# EAGLE design raspicam-lamp (EAGLE 9.1.0)
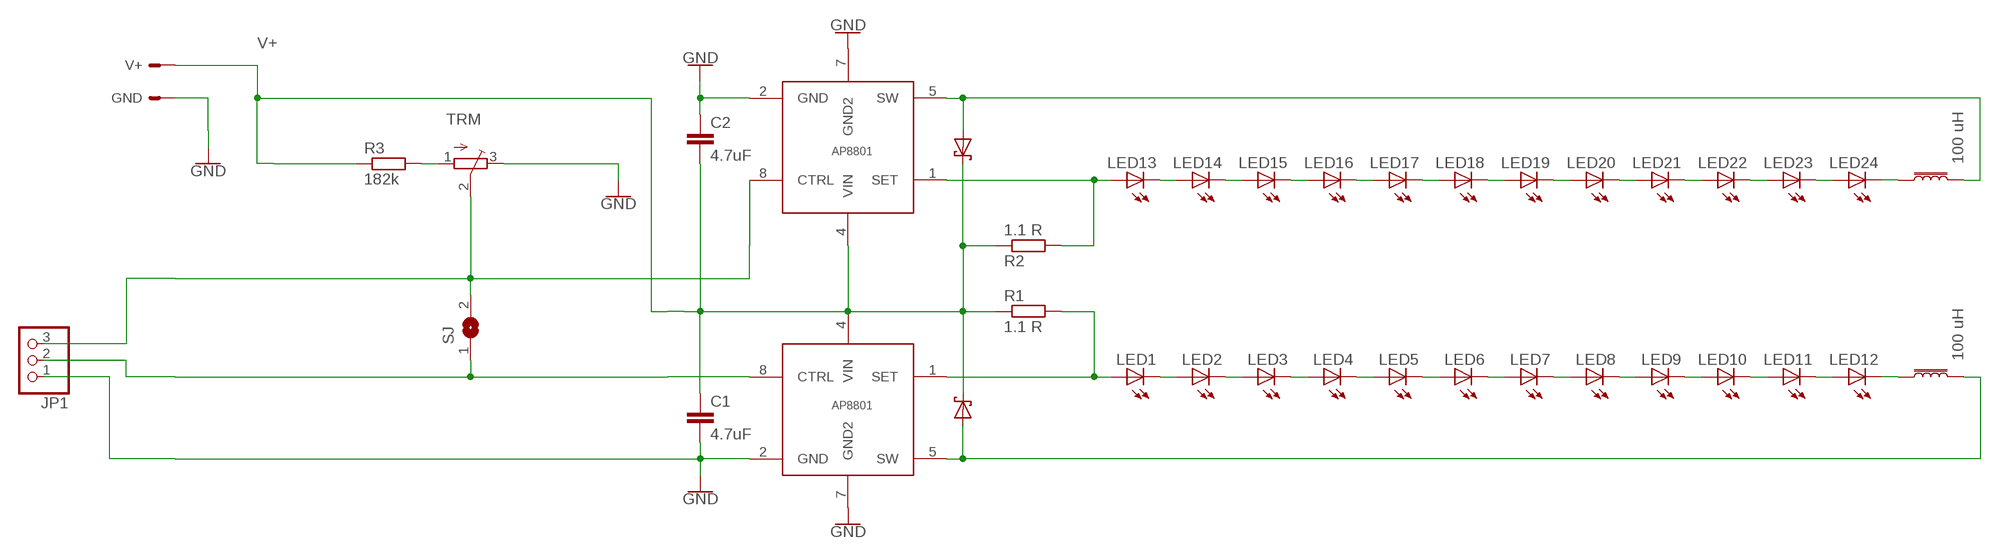
[diagram p0: schematic, sheet 1]

## Parts
C1  4.7uF  C-EUC3225  [C3225]
C2  4.7uF  C-EUC3225  [C3225]
GND  PWR_PAD  [PWR_PAD_FP]
JP1  PINHD-1X03_2.54-SMD-90°  [1X03SMD/90]
L1  100 uH  SRN8040TA-101M  [SRN8040TA-101M]
L2  100 uH  SRN8040TA-101M  [SRN8040TA-101M]
LED1  GW-JDSTS2.EM  [GW-JDSTS2.EM]
LED2  GW-JDSTS2.EM  [GW-JDSTS2.EM]
LED3  GW-JDSTS2.EM  [GW-JDSTS2.EM]
LED4  GW-JDSTS2.EM  [GW-JDSTS2.EM]
LED5  GW-JDSTS2.EM  [GW-JDSTS2.EM]
LED6  GW-JDSTS2.EM  [GW-JDSTS2.EM]
LED7  GW-JDSTS2.EM  [GW-JDSTS2.EM]
LED8  GW-JDSTS2.EM  [GW-JDSTS2.EM]
LED9  GW-JDSTS2.EM  [GW-JDSTS2.EM]
LED10  GW-JDSTS2.EM  [GW-JDSTS2.EM]
LED11  GW-JDSTS2.EM  [GW-JDSTS2.EM]
LED12  GW-JDSTS2.EM  [GW-JDSTS2.EM]
LED13  GW-JDSTS2.EM  [GW-JDSTS2.EM]
LED14  GW-JDSTS2.EM  [GW-JDSTS2.EM]
LED15  GW-JDSTS2.EM  [GW-JDSTS2.EM]
LED16  GW-JDSTS2.EM  [GW-JDSTS2.EM]
LED17  GW-JDSTS2.EM  [GW-JDSTS2.EM]
LED18  GW-JDSTS2.EM  [GW-JDSTS2.EM]
LED19  GW-JDSTS2.EM  [GW-JDSTS2.EM]
LED20  GW-JDSTS2.EM  [GW-JDSTS2.EM]
LED21  GW-JDSTS2.EM  [GW-JDSTS2.EM]
LED22  GW-JDSTS2.EM  [GW-JDSTS2.EM]
LED23  GW-JDSTS2.EM  [GW-JDSTS2.EM]
LED24  GW-JDSTS2.EM  [GW-JDSTS2.EM]
R1  1.1 R  R-EU_R0603  [R0603]
R2  1.1 R  R-EU_R0603  [R0603]
R3  182k  R-EU_R0603  [R0603]
SD1  SCHOTTKY-DO-2014AC  [SCHOTTKY-DO-214AC]
SD2  SCHOTTKY-DO-2014AC  [SCHOTTKY-DO-214AC]
SJ  SJ  [SJ]
TRM  TRIMPOTTC33X  [TC33X]
U$1  AP8801  [SO08]
U$2  AP8801  [SO08]
V+  PWR_PAD  [PWR_PAD_FP]

## Nets
GND: C1.2 C2.1 GND.P$1(S) JP1.1 TRM.3(E) U$1.2(GND) U$1.7(GND2) U$2.2(GND) U$2.7(GND2)
N$1: L1.2 SD2.A U$2.5(SW)
N$3: LED1.A R1.2 U$1.1(SET)
N$4: JP1.2 SJ.1 U$1.8(CTRL)
N$5: R3.2 TRM.1(A)
N$6: JP1.3 SJ.2 TRM.2(S) U$2.8(CTRL)
N$7: L2.2 SD1.A U$1.5(SW)
N$8: LED13.A R2.2 U$2.1(SET)
N$9: LED1.C LED2.A
N$10: LED2.C LED3.A
N$11: LED3.C LED4.A
N$12: LED4.C LED5.A
N$13: LED5.C LED6.A
N$14: LED6.C LED7.A
N$15: LED7.C LED8.A
N$16: LED8.C LED9.A
N$17: LED9.C LED10.A
N$18: LED10.C LED11.A
N$19: LED11.C LED12.A
N$20: LED13.C LED14.A
N$21: LED14.C LED15.A
N$22: LED15.C LED16.A
N$23: LED16.C LED17.A
N$24: LED17.C LED18.A
N$25: LED18.C LED19.A
N$26: LED19.C LED20.A
N$27: LED20.C LED21.A
N$28: LED21.C LED22.A
N$29: LED22.C LED23.A
N$30: LED23.C LED24.A
N$31: L2.1 LED12.C
N$32: L1.1 LED24.C
V+: C1.1 C2.2 R1.1 R2.1 R3.1 SD1.C SD2.C U$1.4(VIN) U$2.4(VIN) V+.P$1(S)

## Library data of the parts
C1 C2 = rcl:C-EU: CAPACITOR, European symbol; SPICEPREFIX: C
GND V+ = con_usr:PWR_PAD
JP1 = pinhead-2:PINHD-1X03: PIN HEADER
L1 L2 = LightLibrary:SRN8040TA-101M
LED1-LED24 = LightLibrary:GW-JDSTS2.EM
R1-R3 = rcl:R-EU_: RESISTOR, European symbol; SPICEPREFIX: R
SD1 SD2 = LightLibrary:SCHOTTKY-DO-2014AC
SJ = jumper:SJ: SMD solder JUMPER
TRM = adafruit:TRIMPOT: SMT trimmer potentiometer part number TC33X http://www.ladyada.net/library/eagle
U$1 U$2 = LightLibrary:AP8801

## Board
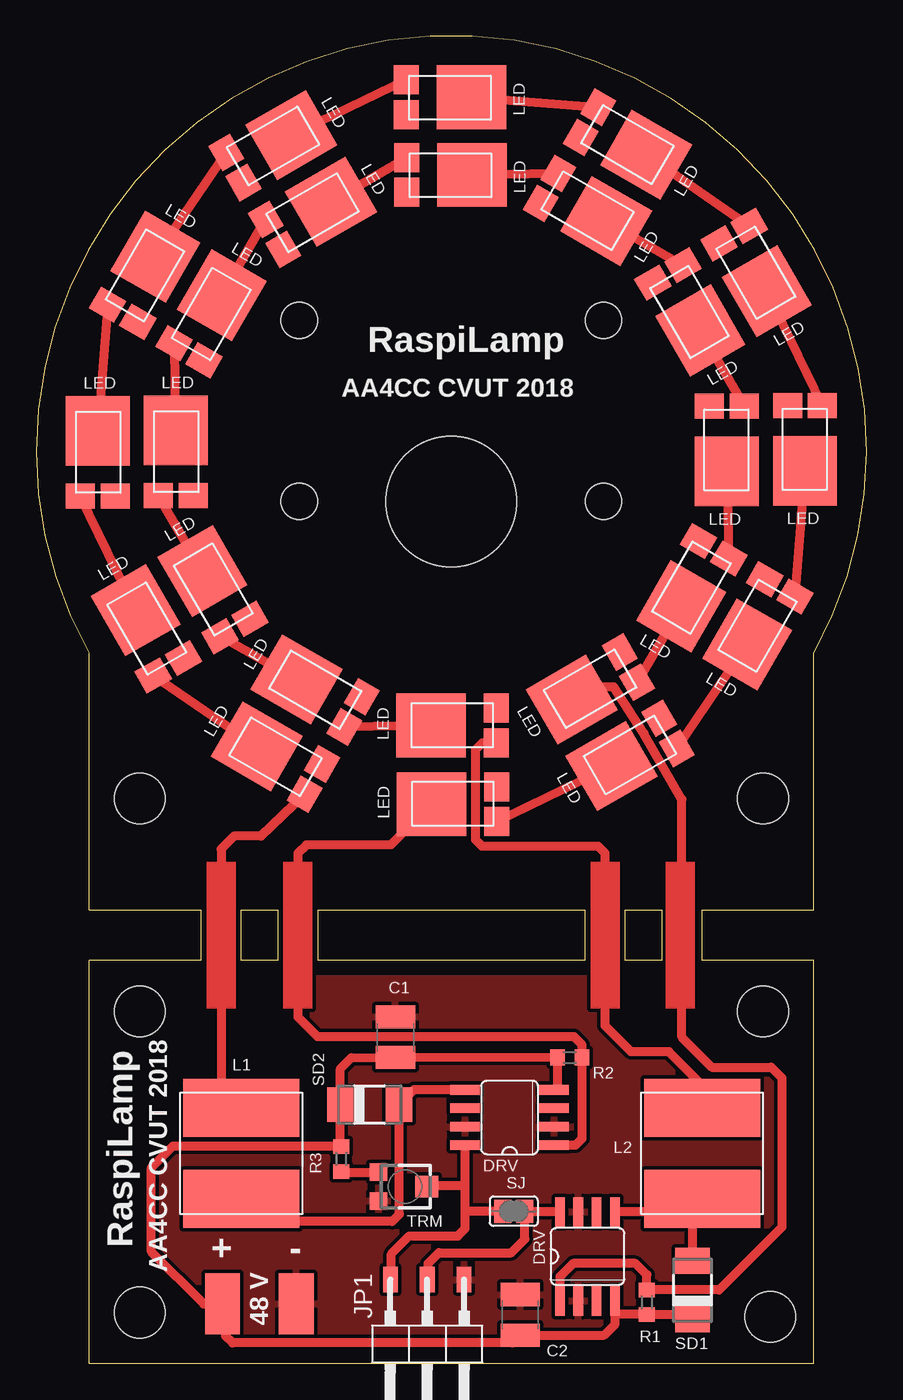
[diagram p1: board, top side]

Size 57.31 x 91.62 mm. Coordinates in mm from the lower left corner, seen from the top.
Outline: 3.65,0 53.65,0 53.65,27.8 45.95,27.8 45.95,31.3 53.65,31.3 53.65,49 arc238 3.65,49 3.65,31.3 11.35,31.3 11.35,27.8 3.65,27.8 3.65,0
Outline: 14.15,31.3 16.65,31.3 16.65,27.8 14.15,27.8 14.15,31.3
Outline: 19.45,31.3 37.85,31.3 37.85,27.8 19.45,27.8 19.45,31.3
Outline: 40.65,31.3 43.15,31.3 43.15,27.8 40.65,27.8 40.65,31.3
Copper layers (1*16): Top 0.035mm / dielectric 1.5mm / Bottom 0.035mm
Design rules "default *": minimum track width 6mil, minimum drill 0.35mm, track to track 10mil, track to pad 10mil, pad to pad 10mil, via to via 10mil, smd to smd 10mil, copper to edge 40mil, drill to drill 10mil, minimum pad ring 10mil, minimum via ring 8mil, stop-mask expansion 4mil, vias tented up to drill 0mil, thermal gap 10mil
Holes 9 mm at 28.65,59.5
Holes 2.5 mm at 18.15,72 39.15,72 18.15,59.5 39.15,59.5
Holes 3.5 mm at 7.15,39 50.15,39 7.15,3.5 50.65,3.2 7.15,24.3 50.15,24.3

### Footprints (pad centres in the part's own frame; a part is rotated, then mirrored left to right if it is on the bottom)
C3225 = smd 1.6 x 2.7: 1 -1.4,0; 2 1.4,0
PWR_PAD_FP = smd 2.4 x 4.2: P$1 0,0
1X03SMD/90 = smd 1.016 x 1.778: 1 -1.27,-5.08; 2 1.27,-5.08; 3 3.81,-5.08
SRN8040TA-101M = smd 8 x 4: 1 0,3.15; 2 0,-3.15
GW-JDSTS2.EM = smd 4.8 x 4.4: A -1.377,0 | smd 1.73 x 2: C 3.127,-1.2; C2 3.127,1.2
R0603 = smd 1 x 1.1: 1 -0.85,0; 2 0.85,0
SCHOTTKY-DO-214AC = smd 1.8 x 2.4: A 2.025,0; C -2.025,0
SJ = smd 1.168 x 1.6: 1 -0.762,0; 2 0.762,0
TC33X = smd 1.2 x 1.2: 1 -1,-1.825; 3 1,-1.825 | smd 1.5 x 1.6: 2 0,1.5
SO08 = smd 0.66 x 2.032: 1 -1.905,-3.073; 2 -0.635,-3.073; 3 0.635,-3.073; 4 1.905,-3.073; 5 1.905,3.073; 6 0.635,3.073; 7 -0.635,3.073; 8 -1.905,3.073

### Placement (x,y rotation side)
C1  24.79,22.51 90 top
C2  33.41,3.34 270 top
GND  17.95,4.1 0 top
JP1  28.25,0.7 180 top
L1  14.15,14.5 0 top
L2  45.95,14.5 0 top
LED1  38.15,46.5 30 top
LED2  45.19,53.45 60 top
LED3  47.65,62.95 90 top
LED4  45.15,72.5 120 top
LED5  38.13,79.54 150 top
LED6  28.69,82.04 180 top
LED7  19.15,79.5 210 top
LED8  12.11,72.54 240 top
LED9  9.63,63.03 270 top
LED10  12.15,53.5 300 top
LED11  19.15,46.53 330 top
LED12  28.61,44.03 0 top
LED13  28.65,38.6 0 top
LED14  40.89,41.92 30 top
LED15  49.75,50.82 60 top
LED16  53.05,63 90 top
LED17  49.73,75.21 120 top
LED18  40.89,84.11 150 top
LED19  28.65,87.4 180 top
LED20  16.41,84.11 210 top
LED21  7.53,75.2 240 top
LED22  4.25,63 270 top
LED23  7.55,50.8 300 top
LED24  16.41,41.9 330 top
R1  42.14,4.22 90 top
R2  36.82,21.11 0 top
R3  21.05,14.1 270 top
SD1  45.29,5.05 90 top
SD2  23.01,17.86 0 top
SJ  32.95,10.5 180 top
TRM  25.45,12.2 270 top
U$1  38.04,7.38 0 top
U$2  32.67,16.97 90 top
V+  12.85,4.1 0 top

### Tracks (layer width: path | path; a pad name or v marks a point on that pad's centre or on a via)
GND
  pour Top: 2.85,28.5 2.85,-1.3 54.75,-1.3 54.75,28.5
N$1
  Top 0.61: U$2.5 29.6,18.9 26.08,18.9 SD2.A 25.05,17.84 25.05,10.3 24.55,9.8 15.7,9.8 L1.2
N$3
  Top 0.61: LED1.A 36.96,46.7 39.85,46.7 41.93,43.48 44.55,38.93 44.55,22.5 46.62,20.43 50.72,20.43 51.45,19.7 51.45,9.4 47.12,5.07 R1.2 42.14,6.11 41.35,6.9 37.05,6.9 36.14,5.98 U$1.1
N$4
  Top 0.61: U$1.8 36.09,10.5 SJ.1 33.71,8.56 32.79,7.64 27.79,7.64 27.04,6.89 27.04,5.84 JP1.2
N$5
  Top 0.61: TRM.1 21.1,13.2 R3.2
N$6
  Top 0.61: 29.6,10.5 29.6,9.31 29.09,8.8 25.75,8.8 24.5,7.55 24.5,5.84 JP1.3 | 29.6,10.5 29.6,12.3 | 29.6,12.3 U$2.8 | TRM.2 27.05,12.3 29.6,12.3 | SJ.2 29.6,10.5
N$7
  Top 0.61: U$1.5 45.41,10.45 45.29,10.34 | L2.2 45.29,10.69 45.29,10.34 | SD1.A 45.29,10.34
N$8
  Top 0.61: LED13.A 24.48,35.8 18.65,35.8 18.05,35.2 18.05,23.9 19.42,22.54 37.12,22.54 37.67,21.98 R2.2 37.67,15.52 37.22,15.06 U$2.1
N$9
  Top 0.61: LED2.A LED1.C
N$10
  Top 0.61: LED3.A LED2.C
N$11
  Top 0.61: LED4.A LED3.C
N$12
  Top 0.61: LED5.A LED4.C
N$13
  Top 0.61: LED6.A LED5.C
N$14
  Top 0.61: LED7.A LED6.C
N$15
  Top 0.61: LED8.A LED7.C
N$16
  Top 0.61: LED9.A 9.63,64.28 9.57,70.54 LED8.C
N$17
  Top 0.61: LED10.A LED9.C
N$18
  Top 0.61: LED11.A LED10.C
N$19
  Top 0.61: LED12.A LED11.C
N$20
  Top 0.61: LED13.C LED14.A
N$21
  Top 0.61: LED15.A LED14.C
N$22
  Top 0.61: LED16.A LED15.C
N$23
  Top 0.61: LED17.A LED16.C
N$24
  Top 0.61: LED18.A LED17.C
N$25
  Top 0.61: LED19.A LED18.C
N$26
  Top 0.61: LED20.A LED19.C
N$27
  Top 0.61: LED21.A LED20.C
N$28
  Top 0.61: LED21.C LED22.A
N$29
  Top 0.61: LED23.A LED22.C
N$30
  Top 0.61: LED24.A LED23.C
N$31
  Top 0.61: LED12.C 30.78,42.83 30.31,42.35 30.31,36.15 30.75,35.7 38.75,35.7 39.25,35.2 39.25,23.3 41.05,21.5 43.65,21.5 45.95,19.2 L2.1
N$32
  Top 0.61: L1.1 12.75,17.68 12.75,35.5 13.65,36.4 15.51,36.4 LED24.C
V+
  Top 0.61: U$2.4 35.97,19.1 R2.1 35.94,21.14 C1.1 21.75,21.1 20.99,20.33 SD2.C 20.99,15.02 R3.1 21,15 9.45,15 7.95,13.5 7.95,7.7 11.55,4.1 V+.P$1 12.85,2.8 12.99,2.66 13.05,1.9 13.55,1.4 32.87,1.4 C2.2 39.19,1.94 39.95,2.7 39.95,3.4 | 39.95,3.4 U$1.4 | 39.95,3.4 42.11,3.4 R1.1 44.95,3.37 SD1.C
(copper drawn outside any net)
  shapes: Top area x4

### Text on the board
tNames: RaspiLamp | AA4CC CVUT 2018 | RaspiLamp | + | - | AA4CC CVUT 2018 | 48 V